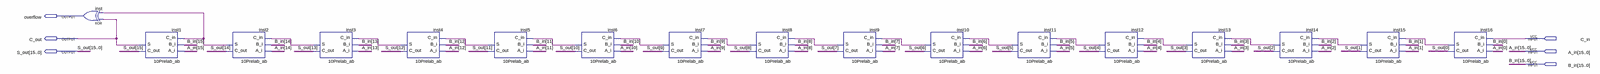
[diagram p0: schematic sheet, whole]
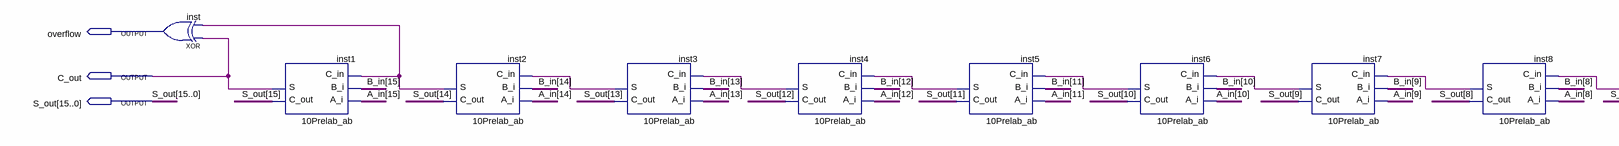
[diagram p1: schematic sheet, left part]
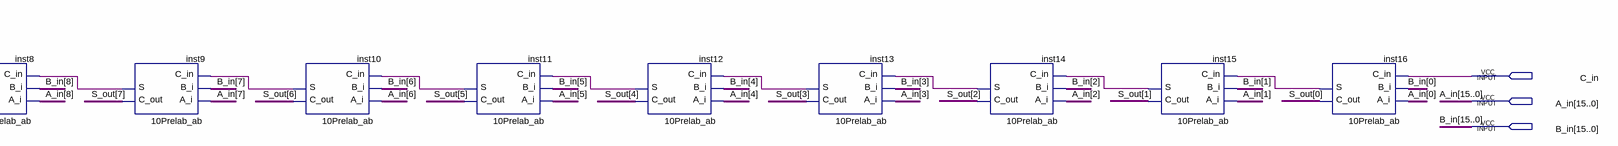
[diagram p2: schematic sheet, right part]
// Quartus schematic 10_16BitFullAdder_With_Overflow.bdf as structural Verilog: 17 symbols, 6 pins
module \10_16BitFullAdder_With_Overflow  (
  input  C_in,
  input  [15:0] A_in,
  input  [15:0] B_in,
  output overflow,
  output C_out,
  output [15:0] S_out
);

  wire inst2_s, inst3_s, inst4_s, inst5_s, inst6_s, inst7_s, inst8_s, inst9_s, inst10_s, inst11_s, inst12_s,
       inst13_s, inst14_s, inst15_s, inst16_s;

  xor inst (overflow, C_out, inst2_s);
  \10Prelab_ab  inst1 (.A_i(A_in[15]), .B_i(B_in[15]), .C_in(inst2_s), .C_out(S_out[15]), .S(C_out));
  \10Prelab_ab  inst2 (.A_i(A_in[14]), .B_i(B_in[14]), .C_in(inst3_s), .C_out(S_out[14]), .S(inst2_s));
  \10Prelab_ab  inst3 (.A_i(A_in[13]), .B_i(B_in[13]), .C_in(inst4_s), .C_out(S_out[13]), .S(inst3_s));
  \10Prelab_ab  inst4 (.A_i(A_in[12]), .B_i(B_in[12]), .C_in(inst5_s), .C_out(S_out[12]), .S(inst4_s));
  \10Prelab_ab  inst5 (.A_i(A_in[11]), .B_i(B_in[11]), .C_in(inst6_s), .C_out(S_out[11]), .S(inst5_s));
  \10Prelab_ab  inst6 (.A_i(A_in[10]), .B_i(B_in[10]), .C_in(inst7_s), .C_out(S_out[10]), .S(inst6_s));
  \10Prelab_ab  inst7 (.A_i(A_in[9]), .B_i(B_in[9]), .C_in(inst8_s), .C_out(S_out[9]), .S(inst7_s));
  \10Prelab_ab  inst8 (.A_i(A_in[8]), .B_i(B_in[8]), .C_in(inst9_s), .C_out(S_out[8]), .S(inst8_s));
  \10Prelab_ab  inst9 (.A_i(A_in[7]), .B_i(B_in[7]), .C_in(inst10_s), .C_out(S_out[7]), .S(inst9_s));
  \10Prelab_ab  inst10 (.A_i(A_in[6]), .B_i(B_in[6]), .C_in(inst11_s), .C_out(S_out[6]), .S(inst10_s));
  \10Prelab_ab  inst11 (.A_i(A_in[5]), .B_i(B_in[5]), .C_in(inst12_s), .C_out(S_out[5]), .S(inst11_s));
  \10Prelab_ab  inst12 (.A_i(A_in[4]), .B_i(B_in[4]), .C_in(inst13_s), .C_out(S_out[4]), .S(inst12_s));
  \10Prelab_ab  inst13 (.A_i(A_in[3]), .B_i(B_in[3]), .C_in(inst14_s), .C_out(S_out[3]), .S(inst13_s));
  \10Prelab_ab  inst14 (.A_i(A_in[2]), .B_i(B_in[2]), .C_in(inst15_s), .C_out(S_out[2]), .S(inst14_s));
  \10Prelab_ab  inst15 (.A_i(A_in[1]), .B_i(B_in[1]), .C_in(inst16_s), .C_out(S_out[1]), .S(inst15_s));
  \10Prelab_ab  inst16 (.A_i(A_in[0]), .B_i(B_in[0]), .C_in(C_in), .C_out(S_out[0]), .S(inst16_s));
endmodule
